# Altium schematic sheet 12_IR.SchDoc
size A4
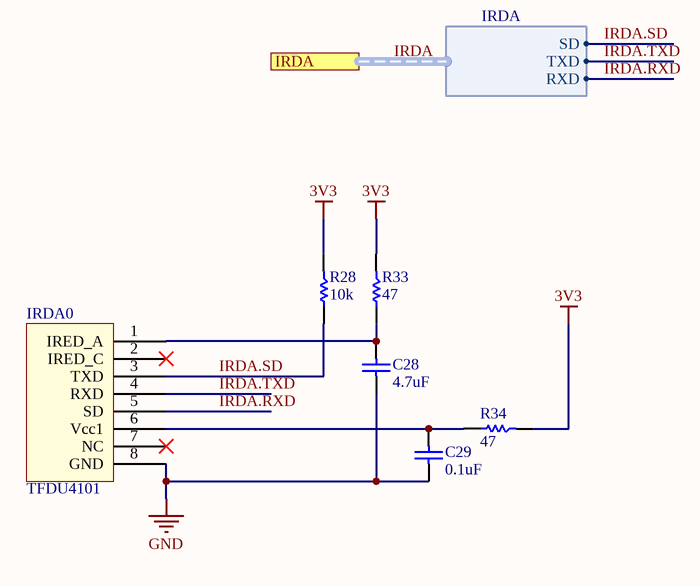
[diagram p0: 12_IR.SchDoc]

## Parts
C28  4.7uF  [CAP0805R]
C29  0.1uF  [CAP0603R]
IRDA0  TFDU4101  [TFDU4101]
R28  10k  [RES0603R]
R33  47  [RES0603R]
R34  47  [RES0603R]

## Ports
IRDA (harness IRDA)

## Harnesses
IRDA: SD, TXD, RXD

## Nets
3V3: R28.1 R33.1 R34.1
GND: C28.1 C29.2 IRDA0.8(GND)
IRDA.RXD: IRDA0.5(SD) ; port IRDA.RXD
IRDA.SD: IRDA0.3(TXD) R28.2 ; port IRDA.SD
IRDA.TXD: IRDA0.4(RXD) ; port IRDA.TXD
NetC28_2: C28.2 IRDA0.1(IRED_A) R33.2
NetC29_1: C29.1 IRDA0.6(Vcc1) R34.2

Not connected (* = marked no-connect by the designer): IRDA0 2(IRED_C)* 7(NC)*

## Buses and harness runs
harness IRDA = port IRDA

## Library data of the parts
C28 C29 = C: Capacitor; Class I: Passive; Load: YES; Revision: July-2002: Re-released for DXP Platform.; Supplier 1: Digi-Key; Mount: SMD
  C28: Supplier Part Number 1: 445-6859-1-ND; Value: 4.7uF
  C29: Supplier Part Number 1: 311-3560-1-ND; Value: 0.1uF
IRDA0 = TFDU4101: Load: YES; Supplier 1: Digi-Key; Supplier Part Number 1: 751-1071-1-ND; Mount: SMD
R28 R33 R34 = R: Resistor; Load: YES; Mount: SMD; Supplier 1: Digi-Key
  R28: Supplier Part Number 1: 311-10.0KHRCT-ND; Value: 10k
  R33 R34: Supplier Part Number 1: 311-47GRCT-ND; Value: 47